# Altium project STM32G030_HeaderBoard.PrjPcb
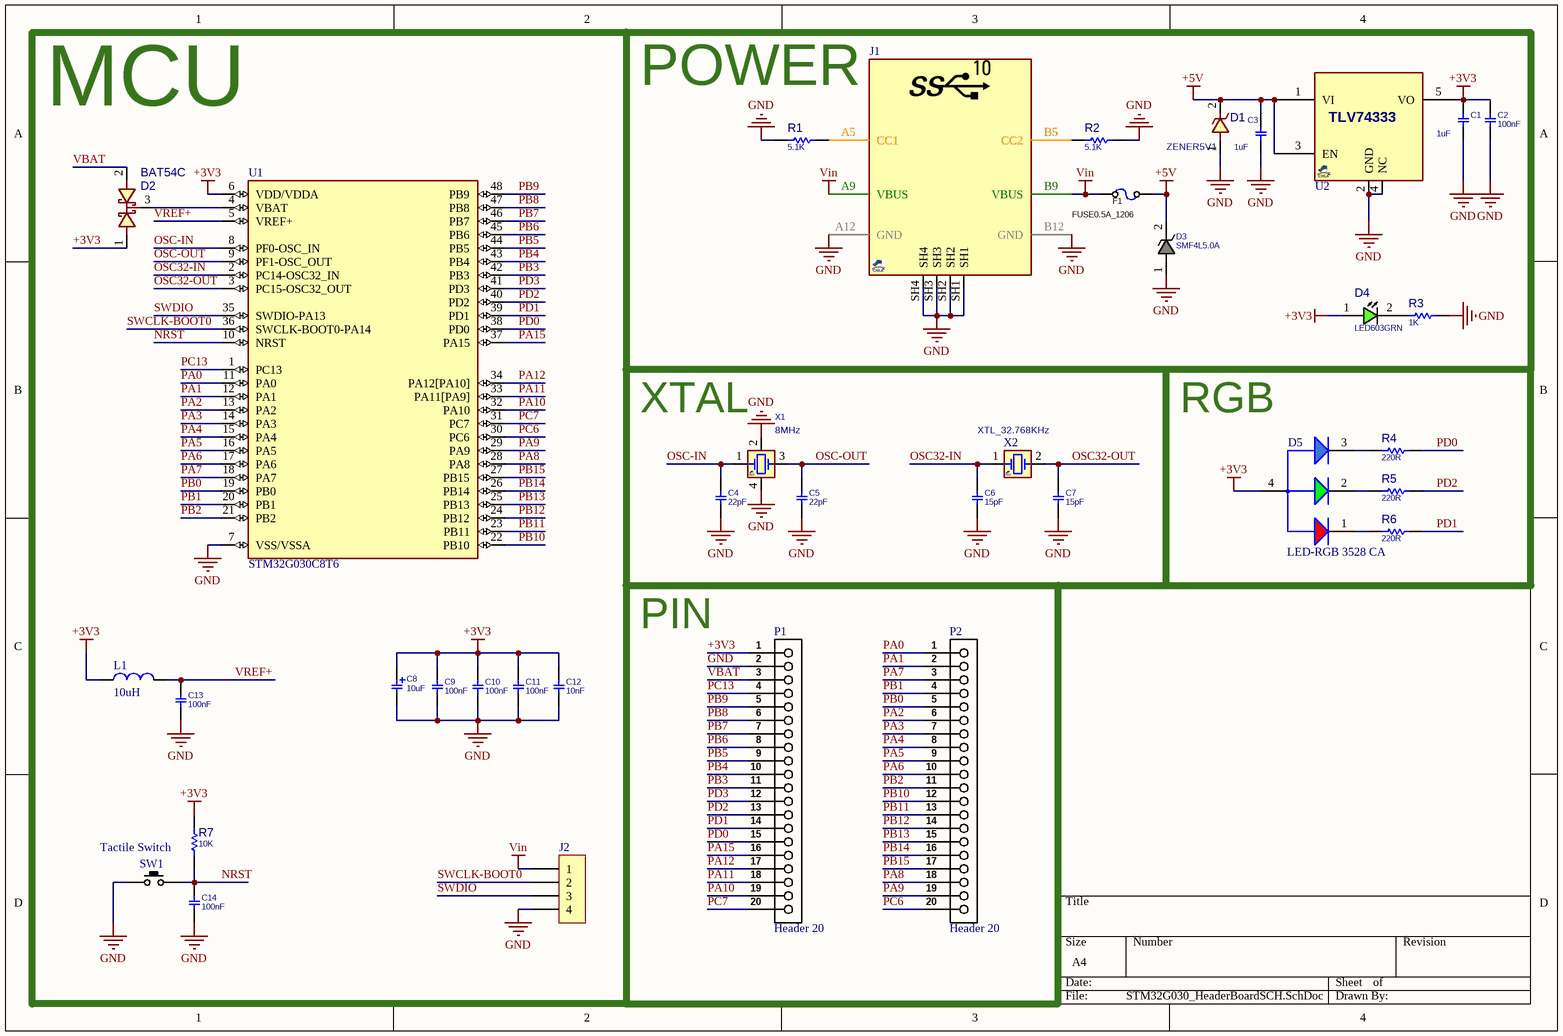
[diagram p0: STM32G030_HeaderBoardSCH.SchDoc]
1 sheet, 37 parts. Net scope: global (net labels, ports and power ports of the same name join across sheets).
Board file: STM32G030_HeaderBoardPCB.PcbDoc

## Sheet STM32G030_HeaderBoardSCH.SchDoc
size A4; SheetNumber: 1; SheetTotal: 1

### Parts
C1  1uF  [C0603]
C2  100nF  [C0603]
C3  1uF  [C0603]
C4  22pF  [C0603]
C5  22pF  [C0603]
C6  15pF  [C0603]
C7  15pF  [C0603]
C8  10uF  [C_TN_3216]
C9  100nF  [C0603]
C10  100nF  [C0603]
C11  100nF  [C0603]
C12  10nF  [C0603]
C13  100nF  [C0603]
C14  100nF  [C0603]
D1  ZENER5V1  [D_SOD123W]
D2  BAT54C  [SOT23_3]
D3  SMF4L5.0A  [D_SOD123W]
D4  LED603GRN  [LED0603GRN]
D5  LED-RGB 3528 CA  [LED-RGB 3528 CA]
F1  FUSE0.5A_1206  [F1206]
J1  UJC-HP-3-SMT  [USBC_SMD_6_UJCHP3SMT]  (value not drawn)
J2  4b  [HDR_THT_4M_2.54mm_RA]  (value not drawn)
L1  10uH  [0603_L]
P1  Header 20  [HDR 1X20 Male Top]
P2  Header 20  [HDR 1X20 Male Top]
R1  5.1K  [R0603]
R2  5.1K  [R0603]
R3  1K  [R0603]
R4  220R  [R0603]
R5  220R  [R0603]
R6  220R  [R0603]
R7  10K  [R0603]
SW1  Tactile Switch  [Tactil Switch 3*4*2]
U1  STM32G030C8T6  [STM32G030C8T6]
U2  TLV74333  [SOT23_5]  (value not drawn)
X1  8MHz  [XTL_4_3225]
X2  XTL_32.768KHz  [XTL_2_3215]

### Blocks framed on the sheet
MCU: C8-C14 D2 J2 L1 R7 SW1 U1

### Nets
+3V3: C1.2 C2.2 C8.1 C9.2 C10.2 C11.2 C12.2 D2.1 D4.1(ANODE) D5.4(COMM_ANODE) L1.1 P1.1 R7.2 U1.6(VDD/VDDA) U2.5(VO)
+5V: C3.2 D1.2 D3.2 F1.2 U2.1(VI) U2.3(EN)
GND: C1.1 C2.1 C3.1 C4.1 C5.1 C6.1 C7.1 C8.2 C9.1 C10.1 C11.1 C12.1 C13.1 C14.1 D1.1 D3.1 J1.A12(GND) J1.B12(GND) J1.SH1 J1.SH2 J1.SH3 J1.SH4 J2.4 P1.2 R1.2 R2.1 R3.1 SW1.1(P1) U1.7(VSS/VSSA) U2.2(GND) U2.4(NC) X1.2 X1.4
Vin: F1.1 J1.A9(VBUS) J1.B9(VBUS) J2.1
NRST: C14.2 R7.1 SW1.2(P3) U1.10(NRST)
OSC32-IN: C6.2 U1.2(PC14-OSC32_IN) X2.1(OSC1)
OSC32-OUT: C7.2 U1.3(PC15-OSC32_OUT) X2.2(OSC2)
OSC-IN: C4.2 U1.8(PF0-OSC_IN) X1.1
OSC-OUT: C5.2 U1.9(PF1-OSC_OUT) X1.3
PA0: P2.1 U1.11(PA0)
PA1: P2.2 U1.12(PA1)
PA2: P2.6 U1.13(PA2)
PA3: P2.7 U1.14(PA3)
PA4: P2.8 U1.15(PA4)
PA5: P2.9 U1.16(PA5)
PA6: P2.10 U1.17(PA6)
PA7: P2.3 U1.18(PA7)
PA8: P2.18 U1.28(PA8)
PA9: P2.19 U1.29(PA9)
PA10: P1.19 U1.32(PA10)
PA11: P1.18 U1.33(PA11[PA9])
PA12: P1.17 U1.34(PA12[PA10])
PA15: P1.16 U1.37(PA15)
PB0: P2.5 U1.19(PB0)
PB1: P2.4 U1.20(PB1)
PB2: P2.11 U1.21(PB2)
PB3: P1.11 U1.42(PB3)
PB4: P1.10 U1.43(PB4)
PB5: P1.9 U1.44(PB5)
PB6: P1.8 U1.45(PB6)
PB7: P1.7 U1.46(PB7)
PB8: P1.6 U1.47(PB8)
PB9: P1.5 U1.48(PB9)
PB10: P2.12 U1.22(PB10)
PB11: P2.13 U1.23(PB11)
PB12: P2.14 U1.24(PB12)
PB13: P2.15 U1.25(PB13)
PB14: P2.16 U1.26(PB14)
PB15: P2.17 U1.27(PB15)
PC6: P2.20 U1.30(PC6)
PC7: P1.20 U1.31(PC7)
PC13: P1.4 U1.1(PC13)
PD0: P1.15 R4.1 U1.38(PD0)
PD1: P1.14 R6.1 U1.39(PD1)
PD2: P1.13 R5.1 U1.40(PD2)
PD3: P1.12 U1.41(PD3)
SWCLK-BOOT0: J2.2 U1.36(SWCLK-BOOT0-PA14)
SWDIO: J2.3 U1.35(SWDIO-PA13)
VBAT: D2.2 P1.3
VREF+: C13.2 L1.2 U1.5(VREF+)
NetD2_3: D2.3 U1.4(VBAT)
NetD4_2: D4.2(CATHODE) R3.2
NetD5_1: D5.1(CATHODE_RED) R6.2
NetD5_2: D5.2(CATHODE_GREEN) R5.2
NetD5_3: D5.3(CATHODE_BLUE) R4.2
NetJ1_A5: J1.A5(CC1) R1.1
NetJ1_B5: J1.B5(CC2) R2.2

### Notes on the sheet
- (near R1) POWER
- (near X1) XTAL
- (near D5) RGB
- PIN

### Library data of the parts
C1-C7 C9-C14 = CAP_SMD_MLCC_0603: CAP, MLCC, -F, -V, MATERIAL, -%, 0201; PARAM: -, -%; MANF_P#: MANF_PART#; PRICE: 100= 1$; MANF: -; PARAM2: -V; ASSEMBLY: ASSEMBLY
  C1 C3: VALUE: 1uF
  C2 C9-C11 C13 C14: VALUE: 100nF
  C4 C5: VALUE: 22pF
  C6 C7: VALUE: 15pF
  C12: VALUE: 10nF
C8 = CAP_SMD_TAN: CAP, SMD, TAN,; PARAM2: -V; VALUE: 10uF
D1 = DIODE_SMD_ZENER_BZT52HC5V1: DIODE, ZENER, 1W, 5.1V; MANF: Diodes; DESC: DESCRIPTION; PARAM2: 1W, 4Ohm, -55~150oC; MANF_P#: BZT52HC5V1WF-7; ASSEMBLY: ASSEMBLY; PRICE: 0.25$; PARAM: 5.1V; VALUE: ZENER5V1
D2 = DIODE_SMD_SCHOTTKY_BAT54C: DIODE, SCHOTTKY, DUAL, 30V, 0.2A; MANF: Diodes; MANF_P#: BAT54C-7-F; DESC: DESCRIPTION; PARAM: 30V/200MW; ASSEMBLY: ASSEMBLY; PRICE: PRICE; PARAM2: 0.2A; VALUE: BAT54C
D3 = TVS_TPSMF4L33A: TVS, ESD PROTECT; MANF: Littelfuse; PARAM2: 33.7VRWM, 37VBR; PARAM: -55~150°C; MANF_P#: TPSMF4L33A; PRICE: 0.5$; VALUE: SMF4L5.0A
D4 = LED_SMD_0603_GRN: LED, SMD, 0603, GREEN; PARAM: 20mA; MANF: Kingbright; DESC: DESCRIPTION; MANF_P#: APT1608SGC; PARAM2: 2.2V; ASSEMBLY: ASSEMBLY; PRICE: 1: 0.14$, 100: 6.8$; VALUE: LED603GRN
D5 = LED-RGB 3528 CA: LED SMD 3528 RGB-CA
F1 = FUSE_3A_1206_SLOW: Fuse, 3A, 32VDC, 1206, SMD, Slow Blow; PARAM: 2A; 32VDC; Slow Blow; MANF: Bourns; MANF_P#: SF-1206SP300-2; PARAM2: 0.027Ohm; PRICE: 0.9$; VALUE: FUSE0.5A_1206
J1 = CONN_USBC_SMD_6_UJC-HP-3-SMT: CONN, USB, Type C (USB 3.1), Right-Angle, SMD; MANF: CUI Devices; PARAM2: 20v; PARAM: Power Only, 3A; Price: 0.8$; MANF_P#: UJC-HP-3-SMT; Value: UJC-HP-3-SMT
J2 = Con_MPH_4x1_V_THT_2.54: Header, single row, 4 pin; Rating: 4x1; Inflow: 7152; Validation: NT; Type: Vertical; Package: Dip; Value: 4b
L1 = Ind_SMD: Inductor; Inflow: inflow?; Type: Type?; Rating: Rating?; Validation: Valid; Package: Package?; Value: 10uH
R1-R7 = RES_SMD_0603: RESISTOR, SMD; PARAM: -W; DESC: DESCRIPTION; DIST#: MOUSER; PARAM2: 1%; MANF_P#: -; MANF: -; ASSEMBLY: ASSEMBLY; PRICE: 100= 0.5$
  R1 R2: VALUE: 5.1K
  R3: VALUE: 1K
  R4-R6: VALUE: 220R
  R7: VALUE: 10K
SW1 = Tactile Switch: 3x6x5 mm - 2 Pin
U1 = STM32G030C8T6: ARMÂ® CortexÂ®-M0+ series Microcontroller IC 32-Bit Single-Core 64MHz 64KB (64K x 8) FLASH 48-LQFP (7x7)
U2 = VREG_TLV74333_SOT23: REG, Linear, LDO0.12V, Fixed, 300mA, VIN1.4~5.5V, VOUT1~5.5V, SOT-23-5; MANF: Texas Instruments; MANF_P#: TLV74333PDQN; PARAM2: 1.4~5.5Vin, LDO0.12V, Fixed3.0V; PARAM: 300mA, 50dB PSRR, -40~125°C; PRICE: $0.3; VALUE: TLV74333
X1 = XTL_4_8MHz_3225: Crystal 8MHz; MANF: ECS; MANF_P#: ECS-80-18-33-JGN-TR; PARAM: 30PPM, 20pF; PRICE: 0.5$; VALUE: 8MHz
X2 = XTL_2_32.768_3215A: Crystal, 32.768KHz, 3pF, 20PPM; MANF: ABRACON; MANF_P#: ABS07W-32.768kHz-D-2-T; PARAM: -40~85oC; PARAM2: 3pF, 20PPM; PRICE: 1$; VALUE: XTL_32.768KHz
P1 P2 = Header 20: Library Link: https://github.com/Majid-Derhambakhsh; Publisher: Majid Derhambakhsh